# EAGLE design 8825cape-V1.0 (EAGLE 7.2.0)
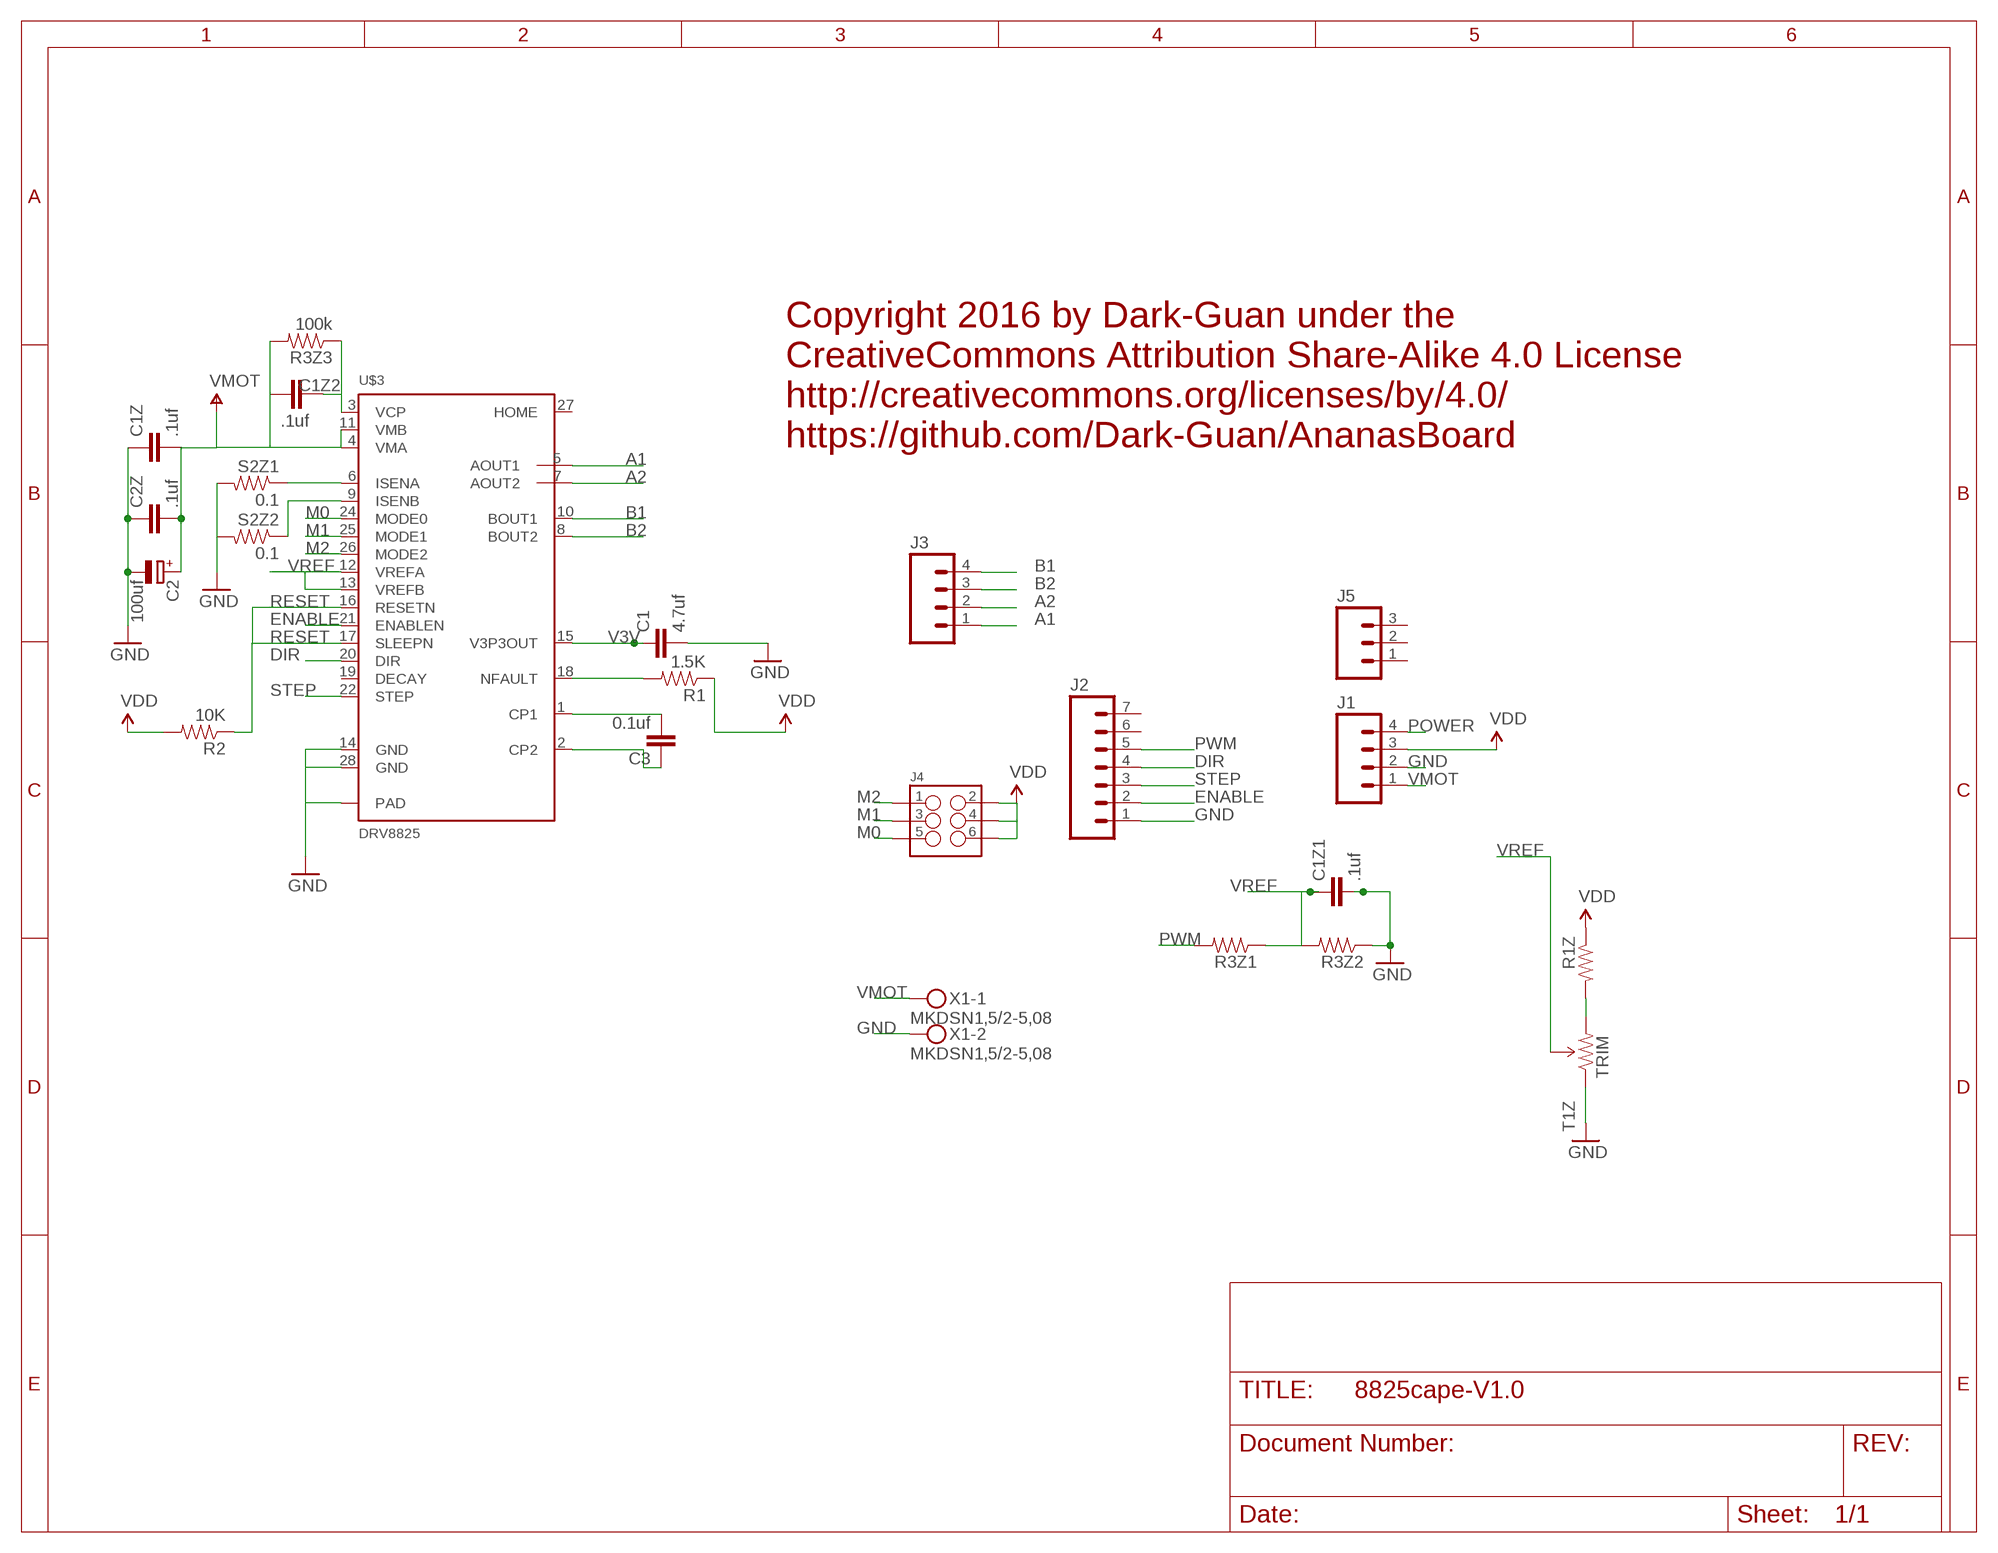
[diagram p0: schematic, sheet 1]

## Parts
C1  4.7uf  CAP0402-CAP  [0402-CAP]
C1Z  .1uf  CAP0402-CAP  [0402-CAP]
C1Z1  .1uf  CAP0402-CAP  [0402-CAP]
C1Z2  .1uf  CAP0402-CAP  [0402-CAP]
C2  100uf  CPOL-EU153CLV-0605  [153CLV-0605]
C2Z  .1uf  CAP0402-CAP  [0402-CAP]
C3  0.1uf  CAP0402-CAP  [0402-CAP]
J1  M04PTH  [1X04]
J2  M07  [1X07]
J3  M04PTH  [1X04]
J4  M03X2NO_SILK  [2X3-NS]
J5  M03PTH  [1X03]
R1  1.5K  RESISTOR0402-RES  [0402-RES]
R1Z  RESISTOR0402-RES  [0402-RES]
R2  10K  RESISTOR0402-RES  [0402-RES]
R3Z1  RESISTOR0402-RES  [0402-RES]
R3Z2  RESISTOR0402-RES  [0402-RES]
R3Z3  100k  RESISTOR0402-RES  [0402-RES]
S2Z1  0.1  RESISTOR  [0805]
S2Z2  0.1  RESISTOR  [0805]
T1Z  TRIM  TRIMPOTSMD  [TRIMPOT-3MM]
U$3  DRV8825  [HTSSOP28]
X1  MKDSN1,5/2-5,08  [MKDSN1,5/2-5,08]

## Nets
A1: J3.1 U$3.5(AOUT1)
A2: J3.2 U$3.7(AOUT2)
B1: J3.4 U$3.10(BOUT1)
B2: J3.3 U$3.8(BOUT2)
DIR: J2.4 U$3.20(DIR)
ENABLE: J2.2 U$3.21(ENABLEN)
GND: C1.2 C1Z1.2 C1Z.1 C2.- C2Z.1 J1.2 J2.1 R3Z2.1 S2Z1.2 S2Z2.2 T1Z.1(CCW) U$3.14(GND) U$3.28(GND) U$3.GND@10(PAD) U$3.GND@11(PAD) U$3.GND@12(PAD) U$3.GND@13(PAD) U$3.GND@14(PAD) U$3.GND@15(PAD) U$3.GND@16(PAD) U$3.GND@17(PAD) U$3.GND@18(PAD) U$3.GND@19(PAD) U$3.GND@20(PAD) U$3.GND@21(PAD) U$3.GND@22(PAD) U$3.GND@23(PAD) U$3.GND@24(PAD) U$3.GND@25(PAD) U$3.GND@26(PAD) U$3.GND@27(PAD) U$3.GND@28(PAD) U$3.GND@29(PAD) U$3.GND@30(PAD) U$3.GND@PAD(PAD) X1.2
M0: J4.5 U$3.24(MODE0)
M1: J4.3 U$3.25(MODE1)
M2: J4.1 U$3.26(MODE2)
N$1: S2Z1.1 U$3.6(ISENA)
N$2: C1Z2.1 R3Z3.1 U$3.3(VCP)
N$3: C3.2 U$3.1(CP1)
N$4: S2Z2.1 U$3.9(ISENB)
N$5: C3.1 U$3.2(CP2)
N$6: R1.2 U$3.18(NFAULT)
POWER: J1.4
PWM: J2.5 R3Z1.2
RESET: R2.1 U$3.16(RESETN) U$3.17(SLEEPN)
STEP: J2.3 U$3.22(STEP)
V3V: C1.1 U$3.15(V3P3OUT)
VDD: J1.3 J4.2 J4.4 J4.6 R1.1 R1Z.1 R2.2
VMOT: C1Z2.2 C1Z.2 C2.+ C2Z.2 J1.1 R3Z3.2 U$3.4(VMA) U$3.11(VMB) X1.1
VREF: C1Z1.1 R3Z1.1 R3Z2.2 T1Z.2(WIPER) U$3.12(VREFA) U$3.13(VREFB)
ZREF2: R1Z.2 T1Z.3(CW)
Unconnected: J2.6 J2.7 J5.1 J5.2 J5.3 U$3.19(DECAY) U$3.27(HOME)

## Notes on the sheet
- Copyright 2016 by Dark-Guan under the
  CreativeCommons Attribution Share-Alike 4.0 License
  http://creativecommons.org/licenses/by/4.0/
  https://github.com/Dark-Guan/AnanasBoard

## Library data of the parts
C1 C1Z C1Z1 C1Z2 C2Z C3 = SparkFun:CAP: Capacitor Standard 0603 ceramic capacitor, and 0.1" leaded capacitor.
C2 = arduino_Uno_Rev3-02-TH:CPOL-EU: POLARIZED CAPACITOR, European symbol
J1 J3 = SparkFun-Connectors:M04: Header 4 Standard 4-pin 0.1" header. Use with straight break away headers (SKU : PRT-00116), right angle break away headers (PRT-00553), swiss pins (PRT-00743), machine pins (PRT-00117), and female headers (PRT-00115). Molex polarized connector foot print use with SKU : PRT-08231 with associated crimp pins and housings. 1MM SMD Version SKU: PRT-10208; PROD_ID: CONN-09696
J2 = SparkFun-Connectors:M07: Header 7 Standard 7-pin 0.1" header. Use with straight break away headers (SKU : PRT-00116), right angle break away headers (PRT-00553), swiss pins (PRT-00743), machine pins (PRT-00117), and female headers (PRT-00115). NOTES ON THE VARIANTS LOCK and LOCK_LONGPADS... This footprint was designed to help hold the alignment of a through-hole component (i.e. 7-pin header) while soldering it into place. You may notice that each hole has been shifted either up or down by 0.005 of an inch from it's more standard position (which is usually a perfectly straight line). This slight alteration caused the pins (the squares in the middle) to touch the edges of the holes. Because they are alternating, it causes a "brace" to hold the header in place. 0.005 has proven to be the perfect amount of "off-center" position when using our standard breakaway headers. Although looks a little odd when you look at the bare footprint, once you have a header in there, the alteration is very hard to notice. Also, if you push a header all the way into place, it is covered up entirely on the bottom side. This idea of altering the position of holes to aid alignment will be further integrated into the Sparkfun Library for other footprints. It can help hold any component with 3 or more connection pins.
J4 = SparkFun-Connectors:M03X2: 2x3 .1" header. Shrouded, with keying- CONN-10681 SMT- CONN-11415 Pogo pins- HW-11044
J5 = SparkFun-Connectors:M03: Header 3 Standard 3-pin 0.1" header. Use with straight break away headers (SKU : PRT-00116), right angle break away headers (PRT-00553), swiss pins (PRT-00743), machine pins (PRT-00117), and female headers (PRT-00115). Molex polarized connector foot print use with SKU : PRT-08232 with associated crimp pins and housings.
R1 R1Z R2 R3Z1-R3Z3 S2Z1 S2Z2 = SparkFun:RESISTOR: Resistor Basic schematic elements and footprints for 0603, 1206, and PTH 1/10th watt (small) resistors.
T1Z = SparkFun:TRIMPOT
U$3 = SparkFun-PowerIC:DRV8825
X1 = con-phoenix-508:MKDSN1,5/2-5,08: MKDSN 1,5/ 2-5,08 Printklemme Nennstrom: 13,5 A Nennspannung: 250 V Rastermaß: 5,08 mm Polzahl: 2 Anschlussart: Schraubanschluss Montage: Löten Anschlussrichtung Leiter/Platine: 0 ° Artikelnummer: 1729128 Source: http://eshop.phoenixcontact.com .. 1729128.pdf

## Board
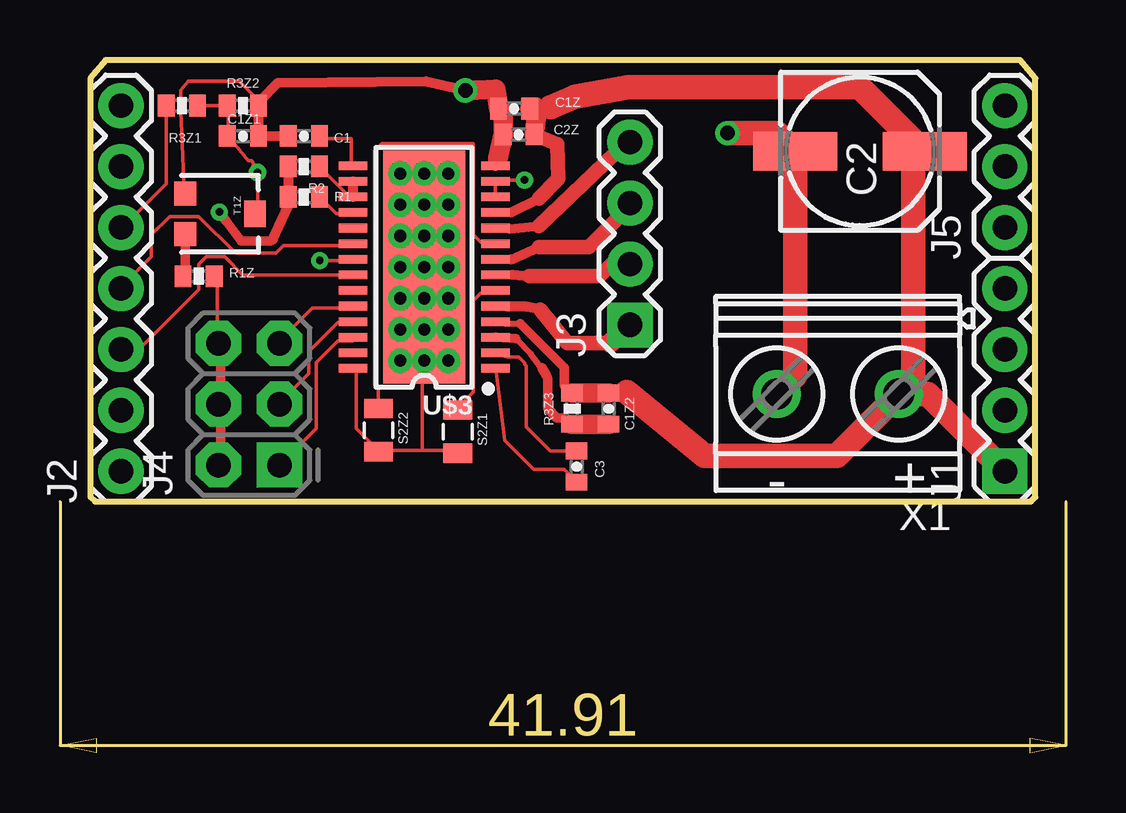
[diagram p1: board, top side]
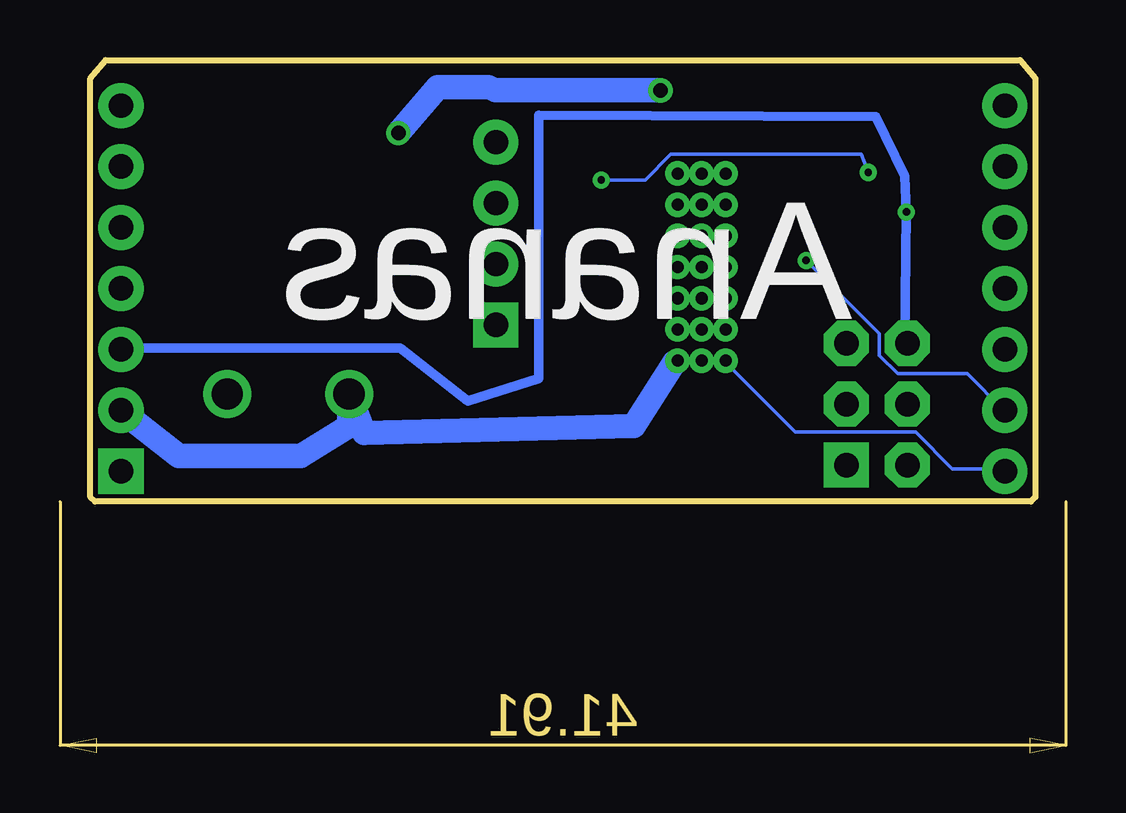
[diagram p2: board, bottom side, seen from below]

Size 40.64 x 19.68 mm. Coordinates in mm from the lower left corner, seen from the top.
Outline: 40.64,0 40.64,1.27
Outline: 0.19,1.27 39.18,1.27 39.37,1.46 39.37,18.92 38.73,19.68 0.64,19.68 0,18.92 0,1.46 0.19,1.27
Copper layers (1*16): Top 0.035mm / dielectric 1.5mm / Bottom 0.035mm
Design rules "dark-2-lays-6mil": minimum track width 6mil, minimum drill 12mil, track to track 6mil, track to pad 6mil, pad to pad 6mil, via to via 6mil, smd to smd 6mil, copper to edge 20mil, drill to drill 8mil, minimum pad ring 10mil, minimum via ring 8mil, stop-mask expansion 4mil, vias tented up to drill 0mil, thermal gap 6mil

### Footprints (pad centres in the part's own frame; a part is rotated, then mirrored left to right if it is on the bottom)
0402-CAP = smd 0.7 x 0.9: 1 -0.65,0; 2 0.65,0
153CLV-0605 = smd 3.5 x 1.6: + 2.7,0; - -2.7,0
1X04 = drill 1.016 pad 1.88 square: 1 0,0 | drill 1.016 pad 1.88: 2 2.54,0; 3 5.08,0; 4 7.62,0
1X07 = drill 1.016 pad 1.88: 1 0,0; 2 2.54,0; 3 5.08,0; 4 7.62,0; 5 10.16,0; 6 12.7,0; 7 15.24,0
2X3-NS = drill 1.016 pad 1.88 square: 1 -2.54,-1.27 | drill 1.016 pad 1.88 octagon: 2 -2.54,1.27; 3 0,-1.27; 4 0,1.27; 5 2.54,-1.27; 6 2.54,1.27
1X03 = drill 1.016 pad 1.88: 1 0,0; 2 2.54,0; 3 5.08,0
0402-RES = smd 0.7 x 0.9: 1 -0.65,0; 2 0.65,0
0805 = smd 0.8 x 1.2: 1 -0.9,0; 2 0.9,0
TRIMPOT-3MM = smd 1 x 0.9: 1 -0.85,-1.45; 3 0.85,-1.45 | smd 1.1 x 0.9: 2 0,1.45
HTSSOP28 = smd 0.36 x 1.19: 1 -4.225,-2.97; 2 -3.575,-2.97; 3 -2.925,-2.97; 4 -2.275,-2.97; 5 -1.625,-2.97; 6 -0.975,-2.97; 7 -0.325,-2.97; 8 0.325,-2.97; 9 0.975,-2.97; 10 1.625,-2.97; 11 2.275,-2.97; 12 2.925,-2.97; 13 3.575,-2.97; 14 4.225,-2.97; 15 4.225,2.97; 16 3.575,2.97; 17 2.925,2.97; 18 2.275,2.97; 19 1.625,2.97; 20 0.975,2.97; 21 0.325,2.97; 22 -0.325,2.97; 23 -0.975,2.97; 24 -1.625,2.97; 25 -2.275,2.97; 26 -2.925,2.97; 27 -3.575,2.97; 28 -4.225,2.97 | drill 0.508: GND@10 -3.9,1; GND@11 -3.9,0; GND@12 -3.9,-1; GND@13 -2.6,-1; GND@14 -2.6,0; GND@15 -2.6,1; GND@16 -1.3,1; GND@17 -1.3,0; GND@18 -1.3,-1; GND@19 0,-1; GND@20 0,0; GND@21 0,1; GND@22 1.3,1; GND@23 1.3,0; GND@24 1.3,-1; GND@25 2.6,-1; GND@26 2.6,0; GND@27 2.6,1; GND@28 3.9,1; GND@29 3.9,0; GND@30 3.9,-1 | smd 9.7 x 3.4: GND@PAD 0,0
MKDSN1,5/2-5,08 = drill 1.3 pad 2: 1 -2.561,0.025; 2 2.519,0.025

### Placement (x,y rotation side)
C1  8.89,16.51 180 top
C1Z  17.65,17.65 0 top
C1Z1  6.35,16.51 0 top
C1Z2  21.59,5.14 90 top
C2  32.07,15.88 0 top
C2Z  17.84,16.57 0 top
C3  20.26,2.73 270 top
J1  38.1,2.54 90 top
J2  1.27,2.54 90 top
J3  22.48,8.64 90 top
J4  6.6,5.33 90 top
J5  38.1,12.7 90 top
R1  8.89,13.97 0 top
R1Z  4.51,10.67 180 top
R2  8.89,15.24 180 top
R3Z1  3.81,17.78 180 top
R3Z2  6.35,17.78 180 top
R3Z3  20.07,5.14 90 top
S2Z1  15.3,4.19 270 top
S2Z2  12,4.25 270 top
T1Z  5.4,13.27 270 top
U$3  13.91,11.05 90 top
X1  31.11,5.78 180 top

### Tracks (layer width: path | path; a pad name or v marks a point on that pad's centre or on a via)
A1
  Top 0.254: U$3.5 17.28,9.33 17.4,9.4
  Top 0.406: 18.73,9.27 18.16,9.4 17.4,9.4
  Top 0.6: 21.65,7.87 19.88,7.87 18.73,9.27
  Top 0.813: J3.1 21.65,7.87
A2
  Top 0.254: U$3.7 17.27,10.67 17.59,10.73
  Top 0.406: 17.59,10.73 18.29,10.67
  Top 0.6: 18.29,10.67 21.21,10.67 21.72,11.18 J3.2
B1
  Top 0.254: U$3.10 17.28,12.64 17.46,12.64
  Top 0.406: 17.46,12.64 18.67,12.76
  Top 0.6: 18.67,12.76 22.35,16.26 J3.4
B2
  Top 0.254: U$3.8 17.27,11.43 17.53,11.37
  Top 0.406: 17.53,11.37 18.67,11.87
  Top 0.6: 18.67,11.87 20.77,11.87 22.48,13.59 J3.3
DIR
  Top 0.152: U$3.20 10.92,11.94 8.03,11.94 7.72,11.63 6.04,11.63 4.52,13.16 3.3,13.16 2.54,12.39 2.54,11.48 1.32,10.26 J2.4
ENABLE  (via drill 0.3)
  Top 0.152: v9.55,11.33 10.92,11.33 U$3.21
  Bottom 0.152: v9.55,11.33 6.5,8.28 6.5,7.37 5.74,6.6 2.85,6.6 1.32,5.08 J2.2
GND  (via drill 0.6)
  Top 0.152: 6.96,16.51 C1Z1.2 7.11,16.52 | T1Z.1 3.91,14.22 3.78,17.11 3.76,17.51 3.76,18.43 4.06,18.8 6.2,18.8 6.96,18.03 R3Z2.1 7.11,18.03 | 16.71,17.42 C1Z.1 | U$3.28 11.07,6.76 11.07,4.32 11.99,3.4 S2Z2.2 12.14,3.4 13.82,3.4 | 13.82,3.4 15.19,3.4 S2Z1.2 | 13.82,7.21 13.06,7.21 U$3.GND@10 | 13.82,7.21 U$3.GND@11 | 13.82,7.21 U$3.GND@20 | U$3.GND@12 14.88,7.21 13.97,7.21 U$3.GND@11 | 13.82,8.43 13.06,8.43 U$3.GND@15 | 13.82,8.43 U$3.GND@14 13.97,8.43 14.88,8.43 U$3.GND@13 | 13.82,8.43 U$3.GND@20 | 13.82,9.8 13.06,9.8 U$3.GND@16 | 13.82,9.8 U$3.GND@17 13.97,9.8 14.88,9.8 U$3.GND@18 | 13.82,9.8 U$3.GND@20 | U$3.GND@21 13.06,11.02 13.82,11.02 U$3.GND@20 | 13.82,12.39 13.06,12.39 U$3.GND@22 | 13.82,12.39 U$3.GND@23 13.97,12.39 14.88,12.39 U$3.GND@24 | 13.82,12.39 U$3.GND@20 | U$3.GND@19 14.88,11.02 13.97,11.02 U$3.GND@20 | 13.82,13.61 13.06,13.61 U$3.GND@27 | 13.82,13.61 U$3.GND@26 13.97,13.61 14.88,13.61 U$3.GND@25 | 13.82,13.61 U$3.GND@20 | 13.82,14.99 13.06,14.99 U$3.GND@28 | 13.82,14.99 U$3.GND@29 13.97,14.99 14.88,14.99 U$3.GND@30 | 13.82,14.99 U$3.GND@20 | 13.82,3.4 13.82,7.06 U$3.GND@11 | C1.2
  Top 0.406: U$3.14 17.09,16.13 16.97,15.56 | 7.11,18.03 7.81,18.73 13.97,18.8 v15.62,18.41 | R3Z2.1 C1Z1.2 | 7.11,16.52 C1.2
  Top 0.813: 17,15.68 16.97,15.56 C2Z.1 17.19,17.53 C1Z.1 16.88,18.46 16.07,18.41 v15.62,18.41
  Top 1.016: X1.2 29.37,6.53 C2.- 28.61,16.64 v26.54,16.64
  Bottom 0.152: J2.1 1.32,2.64 3.45,2.64 4.98,4.17 10.01,4.17 12.9,7.06 U$3.GND@10 | 15.04,7.06 U$3.GND@12
  Bottom 1.016: J1.2 35.69,3.17 30.61,3.17 28.6,4.42 X1.2 27.96,4.14 16.73,4.42 15.04,7.06 | v26.54,16.64 24.89,18.54 22.8,18.54 22.48,18.41 v15.62,18.41
M0
  Top 0.152: U$3.24 10.92,9.35 9.25,9.35 7.87,7.98 J4.5
M1
  Top 0.152: U$3.25 10.92,8.74 10.31,8.74 9.09,7.52 9.09,6.6 7.87,5.38 J4.3
M2
  Top 0.152: J4.1 9.4,4.32 9.4,7.06 10.31,7.98 10.92,7.98 U$3.26
N$1
  Top 0.152: U$3.6 16.87,9.96 16.26,9.96 15.95,9.65 15.95,5.84 15.34,5.23 S2Z1.1
N$2
  Top 0.254: 18.99,6.54 18.35,7.43 17.72,8.06
  Top 0.406: R3Z3.1 19.8,4.76 19.43,4.76 19.05,5.14 19.05,6.41 18.99,6.54 | 18.99,6.54 18.8,6.86 18.86,6.73 18.99,6.54 | 17.72,8.06 U$3.3
  Top 0.813: C1Z2.1 R3Z3.1
N$3
  Top 0.152: C3.2 19.73,2.6 18.48,2.6 17.26,3.82 U$3.1
N$4
  Top 0.152: U$3.9 16.87,12.09 16.26,12.09 15.95,12.39 15.95,16.21 12.14,16.21 11.84,15.9 11.84,6.15 11.99,5.99 11.99,5.23 S2Z2.1
N$5
  Top 0.152: U$3.2 17.37,7.3 17.84,7.3 18.1,7.05 18.1,6.98 18.16,6.92 18.16,4.38 19.16,3.38 C3.1
N$6
  Top 0.152: R1.2 9.73,13.77 10.23,13.27 10.73,13.27 U$3.18
PWM
  Top 0.152: R3Z1.2 3.15,18.03 3.15,14.53 1.32,12.7 J2.5
RESET
  Top 0.152: R2.1 9.73,15.02 10.73,14.02 U$3.17
  Top 0.406: U$3.16 U$3.17
STEP
  Top 0.152: U$3.22 10.92,10.72 6.35,10.72 5.59,11.48 4.83,11.48 4.52,11.18 4.52,10.11 2.08,7.67 1.32,7.67 J2.3
V3V
  Top 0.152: C1.1 9.61,16.39 10.86,16.39 10.86,15.39 U$3.15
VDD  (via drill 0.3)
  Top 0.152: R1Z.1 5.28,10.57 5.28,7.98 J4.6 | 8.23,14.02 R1.1 8.23,13.77 8.24,13.59 | 8.23,15.02 R2.2 | 7.6,12.2 7.48,12.27 7.48,12.14
  Top 0.406: v5.37,13.35 5.65,12.97 6.29,12.14 7.48,12.14 | 7.48,12.14 | J4.2 5.44,2.79 5.44,5.23 J4.4 5.44,5.38 5.44,7.82 J4.6 | 8.23,15.02 8.23,14.02 | 7.6,12.2 8.24,13.59
  Bottom 0.406: J1.3 38.05,7.67 26.47,7.67 23.66,5.46 20.69,6.41 20.7,17.39 6.65,17.32 5.44,14.83 v5.37,13.35 5.44,7.98 J4.6
VMOT
  Top 0.152: 18.69,17.73 18.69,18.03 C1Z.2 | 18.69,16.51 C2Z.2 | 34.7,15.9 C2.+
  Top 0.254: U$3.4 17.27,8.7 17.91,8.7 | U$3.11 17.27,13.27 17.53,13.33 | 18.69,17.73 19.25,18.03 19.18,17.72 | 22.1,5.71 22.29,5.71
  Top 0.406: 22.29,5.71 22.35,5.84 | C1Z2.2 21.67,5.71 22.1,5.71 | R3Z3.2 19.75,6.11 19.75,6.86 17.91,8.7 | 17.53,13.33 18.67,13.91
  Top 0.6: 18.67,13.91 19.5,14.73 19.45,16.18 C2Z.2
  Top 0.813: C1Z.2 18.62,17.59 C2Z.2 | C1Z2.2 R3Z3.2
  Top 1.016: J1.1 34.89,5.75 34.29,5.75 | 34.29,5.75 X1.1 31.1,3.17 25.59,3.17 22.35,5.84 | C2.+ 34.29,15.4 34.29,5.75 | 34.7,15.9 32.05,18.54 22.42,18.54 20.19,18.16 19.18,17.72
VREF  (via drill 0.3)
  Top 0.152: 6.81,13.31 T1Z.2 6.96,13.31 v6.96,15 6.72,15.49 6.57,15.49 5.74,16.51 | U$3.12 16.87,14.07 16.87,14.53 U$3.13 17.02,14.68 v18.09,14.68 | 5.74,16.51 5.74,18.03 R3Z2.2 R3Z1.1 | 5.74,16.51 C1Z1.1
  Bottom 0.152: v18.09,14.68 16.26,14.68 15.19,15.75 7.26,15.75 v6.96,15
ZREF2
  Top 0.406: R1Z.2 3.95,10.76 T1Z.3

### Text on the board
tNames: - | +
bNames: Ananas
_tsilk: C1X | S1X | S2X | C1Y | S1Y | S2Y | C1Z | S1Z | S2Z | C1E | S1E | S2E | C4X | R1X | C4Y | R1Y | C4Z | R1Z | C4E | R1E | C3X | Rev 0.1 | C3Y | Rev 0.1 | C3Z | Rev 0.1 | C3E | Rev 0.1 | C2X | C2Y | C2Z | C2E | R2X | C5X | T1X | R2Y | C5Y | T1Y | R2Z | C5Z | T1Z | R2E | C5E | T1X | R3X | R3Y | R3Z | R3E | C6X | StepStick | C6Y | StepStick | C6Z | StepStick | C6E | StepStick | C7X | A4988 | C7Y | A4988 | C7Z | A4988 | C7E | A4988 | R4X | R4Y | R4Z | R4E
_bsilk: VMOT | GND | 2B | 2A | 1A | 1B | VDD | GND | VMOT | GND | 2B | 2A | 1A | 1B | VDD | GND | VMOT | GND | 2B | 2A | 1A | 1B | VDD | GND | VMOT | GND | 2B | 2A | 1A | 1B | VDD | GND | reprap.org/wiki/stepstick | reprap.org/wiki/stepstick | reprap.org/wiki/stepstick | reprap.org/wiki/stepstick | !ENABLE | MS1 | MS2 | MS3 | !RESET | !SLEEP | STEP | DIRECTION | !ENABLE | MS1 | MS2 | MS3 | !RESET | !SLEEP | STEP | DIRECTION | !ENABLE | MS1 | MS2 | MS3 | !RESET | !SLEEP | STEP | DIRECTION | !ENABLE | MS1 | MS2 | MS3 | !RESET | !SLEEP | STEP | DIRECTION